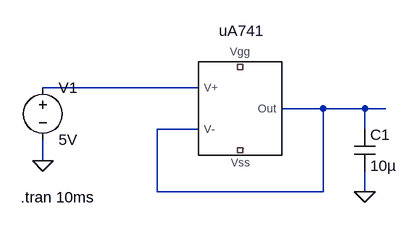
[diagram p0: schematic uA741 Symbol Test.asc]
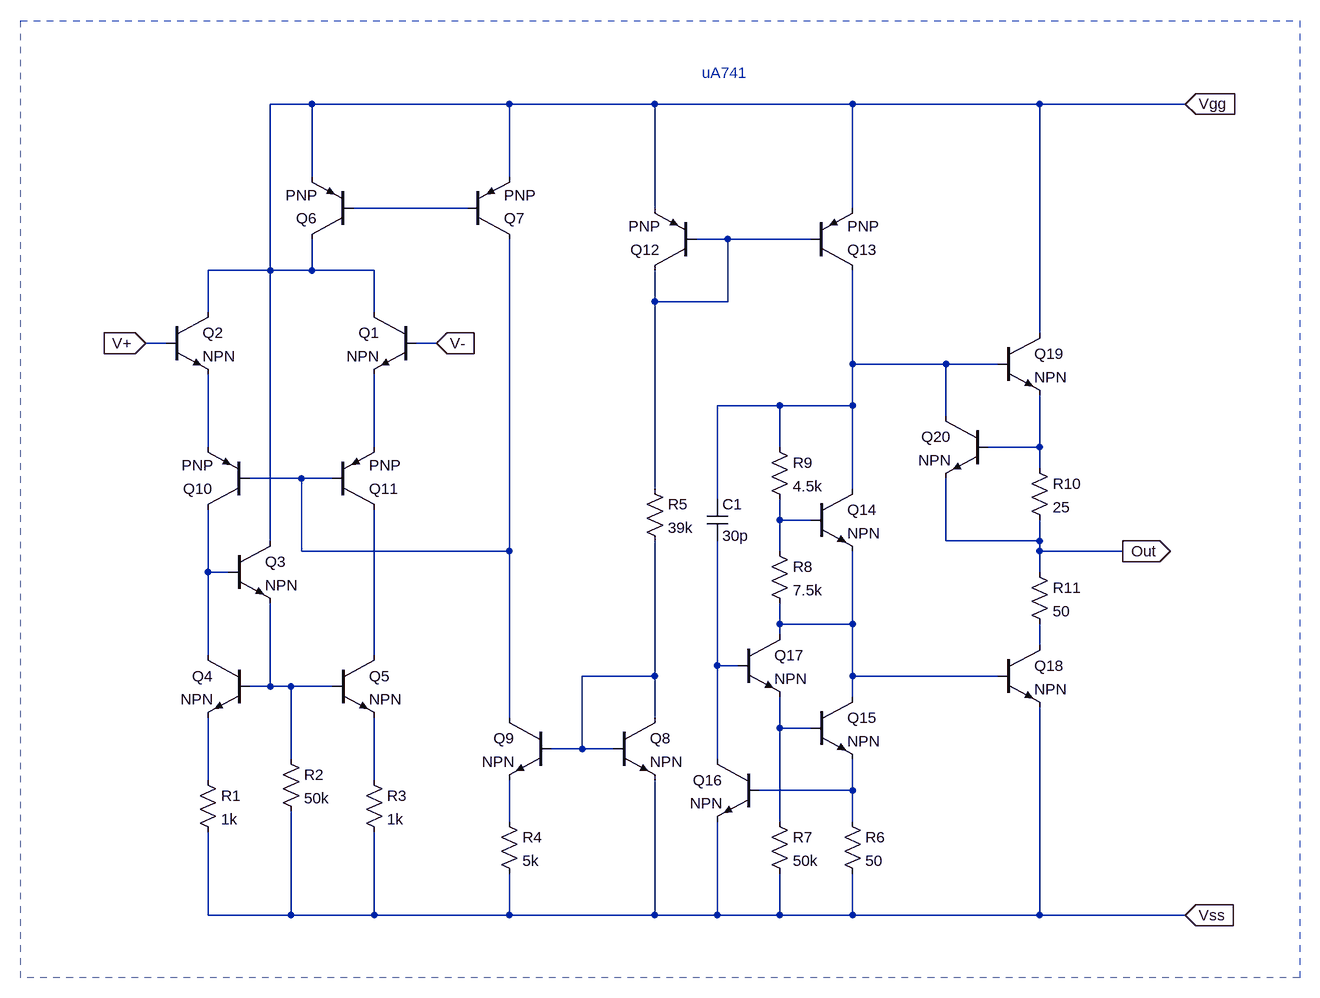
[diagram p1: sub-circuit ua741.asc]
uA741 Symbol Test.asc, the LTspice schematic file:
Version 4
SHEET 1 1796 932
WIRE 192 144 -48 144
WIRE 384 176 320 176
WIRE 448 176 384 176
WIRE 480 176 448 176
WIRE 192 208 128 208
WIRE 448 208 448 176
WIRE -48 256 -48 224
WIRE 128 304 128 208
WIRE 384 304 384 176
WIRE 384 304 128 304
WIRE 448 304 448 272
FLAG -48 256 0
FLAG 448 304 0
SYMBOL uA741 256 176 R0
SYMATTR InstName uA741
SYMBOL voltage -48 128 R0
SYMATTR InstName V1
SYMATTR Value 5V
SYMBOL cap 432 208 R0
SYMATTR InstName C1
SYMATTR Value 10µ
TEXT -82 312 Left 2 !.tran 10ms

ua741.asc, the sub-circuit schematic file:
Version 4
SHEET 1 1796 1092
WIRE -112 -256 -176 -256
WIRE 192 -256 -112 -256
WIRE 416 -256 192 -256
WIRE 720 -256 416 -256
WIRE 1008 -256 720 -256
WIRE 1232 -256 1008 -256
WIRE -112 -144 -112 -256
WIRE 192 -144 192 -256
WIRE 128 -96 -48 -96
WIRE 416 -96 416 -256
WIRE 720 -96 720 -256
WIRE 528 -48 480 -48
WIRE 656 -48 528 -48
WIRE -176 0 -176 -256
WIRE -176 0 -272 0
WIRE -112 0 -112 -48
WIRE -112 0 -176 0
WIRE -16 0 -112 0
WIRE 416 48 416 0
WIRE 528 48 528 -48
WIRE 528 48 416 48
WIRE -272 64 -272 0
WIRE -16 64 -16 0
WIRE 1008 96 1008 -256
WIRE -336 112 -368 112
WIRE 80 112 48 112
WIRE 720 144 720 0
WIRE 864 144 720 144
WIRE 944 144 864 144
WIRE 608 208 512 208
WIRE 720 208 720 144
WIRE 720 208 608 208
WIRE 864 224 864 144
WIRE -272 272 -272 160
WIRE -16 272 -16 160
WIRE 608 272 608 208
WIRE 1008 272 1008 192
WIRE 1008 272 928 272
WIRE 1008 304 1008 272
WIRE -128 320 -208 320
WIRE -80 320 -128 320
WIRE 416 336 416 48
WIRE 720 336 720 208
WIRE 512 352 512 208
WIRE 608 384 608 352
WIRE 656 384 608 384
WIRE -176 416 -176 0
WIRE 864 416 864 320
WIRE 1008 416 1008 384
WIRE 1008 416 864 416
WIRE -128 432 -128 320
WIRE 192 432 192 -48
WIRE 192 432 -128 432
WIRE 608 432 608 384
WIRE 1008 432 1008 416
WIRE 1136 432 1008 432
WIRE -272 464 -272 368
WIRE -240 464 -272 464
WIRE 1008 464 1008 432
WIRE 608 544 608 512
WIRE 720 544 720 432
WIRE 720 544 608 544
WIRE 608 560 608 544
WIRE 1008 576 1008 544
WIRE -272 592 -272 464
WIRE -16 592 -16 368
WIRE 512 608 512 416
WIRE 544 608 512 608
WIRE 416 624 416 416
WIRE 416 624 304 624
WIRE 720 624 720 544
WIRE 944 624 720 624
WIRE -176 640 -176 512
WIRE -176 640 -208 640
WIRE -144 640 -176 640
WIRE -80 640 -144 640
WIRE 720 656 720 624
WIRE 192 688 192 432
WIRE 416 688 416 624
WIRE 608 704 608 656
WIRE 656 704 608 704
WIRE 304 736 304 624
WIRE 304 736 256 736
WIRE 352 736 304 736
WIRE -144 752 -144 640
WIRE 512 752 512 608
WIRE -272 784 -272 688
WIRE -16 784 -16 688
WIRE 720 800 720 752
WIRE 720 800 576 800
WIRE 192 848 192 784
WIRE 608 848 608 704
WIRE 720 848 720 800
WIRE -272 992 -272 864
WIRE -144 992 -144 832
WIRE -144 992 -272 992
WIRE -16 992 -16 864
WIRE -16 992 -144 992
WIRE 192 992 192 928
WIRE 192 992 -16 992
WIRE 416 992 416 784
WIRE 416 992 192 992
WIRE 512 992 512 848
WIRE 512 992 416 992
WIRE 608 992 608 928
WIRE 608 992 512 992
WIRE 720 992 720 928
WIRE 720 992 608 992
WIRE 1008 992 1008 672
WIRE 1008 992 720 992
WIRE 1232 992 1008 992
FLAG 80 112 V-
IOPIN 80 112 In
FLAG -368 112 V+
IOPIN -368 112 In
FLAG 1136 432 Out
IOPIN 1136 432 Out
FLAG 1232 -256 Vgg
IOPIN 1232 -256 In
FLAG 1232 992 Vss
IOPIN 1232 992 In
SYMBOL npn3 48 64 M0
SYMATTR InstName Q1
SYMBOL npn3 -336 64 R0
SYMATTR InstName Q2
SYMBOL npn3 -240 416 R0
SYMATTR InstName Q3
SYMBOL npn3 -208 592 M0
SYMATTR InstName Q4
SYMBOL npn3 -80 592 R0
SYMATTR InstName Q5
SYMBOL pnp2 -48 -48 R180
SYMATTR InstName Q6
SYMBOL pnp2 128 -48 M180
SYMATTR InstName Q7
SYMBOL npn3 352 688 R0
SYMATTR InstName Q8
SYMBOL npn3 256 688 M0
SYMATTR InstName Q9
SYMBOL pnp2 -208 368 R180
SYMATTR InstName Q10
SYMBOL pnp2 -80 368 M180
SYMATTR InstName Q11
SYMBOL res -288 768 R0
SYMATTR InstName R1
SYMATTR Value 1k
SYMBOL res -160 736 R0
SYMATTR InstName R2
SYMATTR Value 50k
SYMBOL res -32 768 R0
SYMATTR InstName R3
SYMATTR Value 1k
SYMBOL res 176 832 R0
SYMATTR InstName R4
SYMATTR Value 5k
SYMBOL res 400 320 R0
SYMATTR InstName R5
SYMATTR Value 39k
SYMBOL pnp2 480 0 R180
SYMATTR InstName Q12
SYMBOL pnp2 656 0 M180
SYMATTR InstName Q13
SYMBOL npn3 656 336 R0
SYMATTR InstName Q14
SYMBOL npn3 656 656 R0
SYMATTR InstName Q15
SYMBOL npn3 576 752 M0
SYMATTR InstName Q16
SYMBOL res 704 832 R0
SYMATTR InstName R6
SYMATTR Value 50
SYMBOL res 592 832 R0
SYMATTR InstName R7
SYMATTR Value 50k
SYMBOL npn3 544 560 R0
SYMATTR InstName Q17
SYMBOL res 592 416 R0
SYMATTR InstName R8
SYMATTR Value 7.5k
SYMBOL res 592 256 R0
SYMATTR InstName R9
SYMATTR Value 4.5k
SYMBOL cap 496 352 R0
SYMATTR InstName C1
SYMATTR Value 30p
SYMBOL npn3 944 576 R0
SYMATTR InstName Q18
SYMBOL npn3 944 96 R0
SYMATTR InstName Q19
SYMBOL npn3 928 224 M0
SYMATTR InstName Q20
SYMBOL res 992 288 R0
SYMATTR InstName R10
SYMATTR Value 25
SYMBOL res 992 448 R0
SYMATTR InstName R11
SYMATTR Value 50
TEXT 488 -304 Left 2 ;uA741
RECTANGLE Normal 1408 1088 -560 -384 2

The netlist it stands for:
* uA741 Symbol Test.asc
XuA741 N001 N002 NC_01 NC_02 N002 ua741
V1 N001 0 5V
C1 N002 0 10µ

* block symbol definitions
.subckt ua741 V+ V- Vgg Vss Out
Q1 Vgg V- N005 0 NPN
Q2 Vgg V+ N004 0 NPN
Q3 Vgg N009 N015 0 NPN
Q4 N009 N015 N017 0 NPN
Q5 N012 N015 N018 0 NPN
Q6 Vgg N001 Vgg 0 PNP
Q7 N007 N001 Vgg 0 PNP
Q8 N014 N014 Vss 0 NPN
Q9 N007 N014 N020 0 NPN
Q10 N009 N007 N004 0 PNP
Q11 N012 N007 N005 0 PNP
R1 N017 Vss 1k
R2 N015 Vss 50k
R3 N018 Vss 1k
R4 N020 Vss 5k
R5 N002 N014 39k
Q12 N002 N002 Vgg 0 PNP
Q13 N003 N002 Vgg 0 PNP
Q14 N003 N008 N010 0 NPN
Q15 N010 N016 N019 0 NPN
Q16 N013 N019 Vss 0 NPN
R6 N019 Vss 50
R7 N016 Vss 50k
Q17 N010 N013 N016 0 NPN
R8 N008 N010 7.5k
R9 N003 N008 4.5k
C1 N003 N013 30p
Q18 N011 N010 Vss 0 NPN
Q19 Vgg N003 N006 0 NPN
Q20 N003 N006 Out 0 NPN
R10 N006 Out 25
R11 Out N011 50
* uA741
.ends ua741

.model NPN NPN
.model PNP PNP
.lib standard.bjt
.tran 10ms
.backanno
.end